# Altium schematic sheet Program Counter Electronic Scheme_2021-10-28.schdoc
size 264 x 133 mm
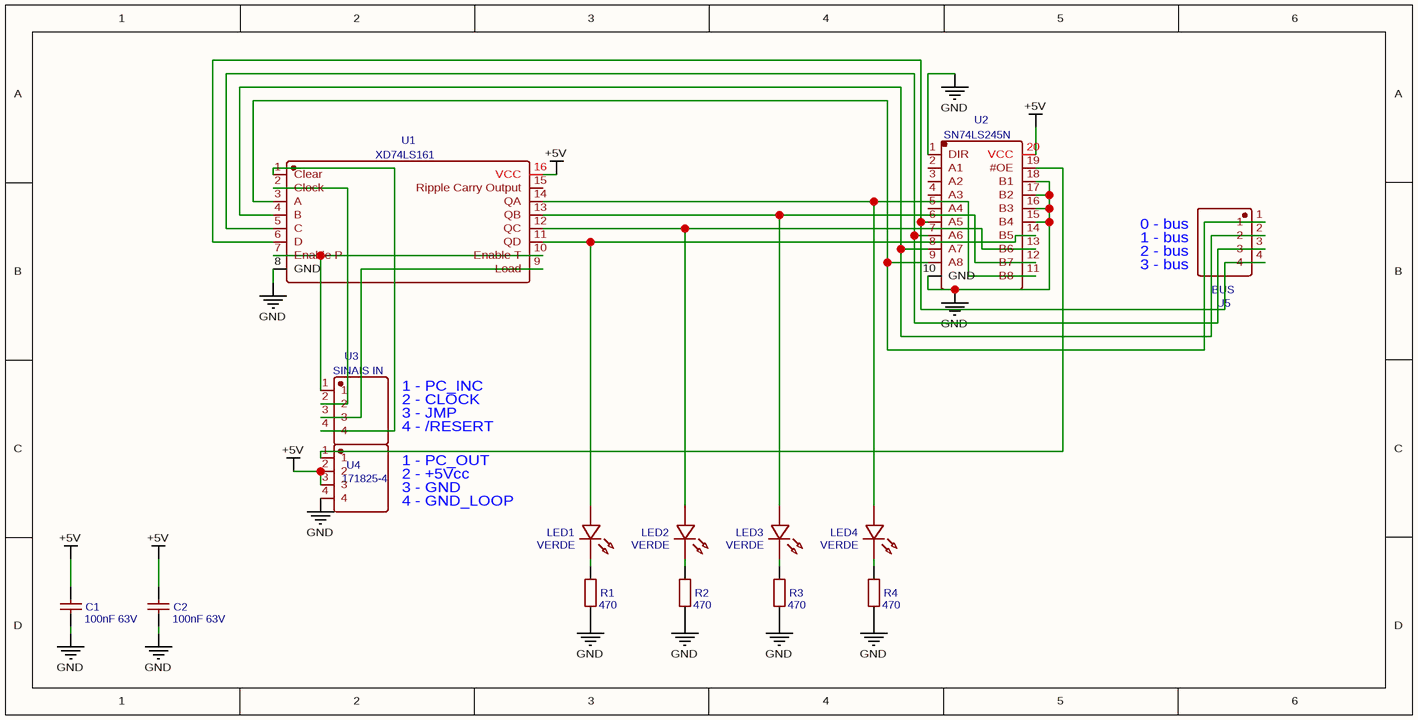
[diagram p0: Program Counter Electronic Scheme_2021-10-28.schdoc]

## Parts
C1  100nF 63V  [CAP-TH_L7.6-W3.8-P5.08-D0.51]
C2  100nF 63V  [CAP-TH_L7.6-W3.8-P5.08-D0.51]
LED1  VERDE  [LED-TH_BD3.0-P2.54-RD-GREEN]
LED2  VERDE  [LED-TH_BD3.0-P2.54-RD-GREEN]
LED3  VERDE  [LED-TH_BD3.0-P2.54-RD-GREEN]
LED4  VERDE  [LED-TH_BD3.0-P2.54-RD-GREEN]
R1  470  [RES-TH_BD3.0-L9.5-P13.50-D0.6]
R2  470  [RES-TH_BD3.0-L9.5-P13.50-D0.6]
R3  470  [RES-TH_BD3.0-L9.5-P13.50-D0.6]
R4  470  [RES-TH_BD3.0-L9.5-P13.50-D0.6]
U1  XD74LS161  [DIP-16_L19.2-W6.6-P2.54-LS7.6-BL]
U2  SN74LS245N  [DIP-20_L25.5-W10.0-P2.54-LS7.6-BL]
U3  SINAIS IN  [HDR-TH_4P-P2.54-D1.0]
U4  171825-4  [HDR-TH_4P-P2.54-D1.0]
U5  BUS  [HDR-TH_4P-P2.54-D1.0]

## Nets
+5V: C1.1 C2.1 U1.16(VCC) U2.20(VCC) U4.2 U4.3
GND: C1.2 C2.2 R1.2 R2.2 R3.2 R4.2 U1.8(GND) U2.1(DIR) U2.10(GND) U2.15(B4) U2.16(B3) U2.17(B2) U2.18(B1) U4.4
NetLED1_1: LED1.1(-) R1.1
NetLED1_2: LED1.2(+) U1.11(QD) U2.14(B5)
NetLED2_1: LED2.1(-) R2.1
NetLED2_2: LED2.2(+) U1.12(QC) U2.13(B6)
NetLED3_1: LED3.1(-) R3.1
NetLED3_2: LED3.2(+) U1.13(QB) U2.12(B7)
NetLED4_1: LED4.1(-) R4.1
NetLED4_2: LED4.2(+) U1.14(QA) U2.11(B8)
NetU1_1: U1.1(Clear) U3.4
NetU1_2: U1.2(Clock) U3.2
NetU1_3: U1.3(A) U2.9(A8) U5.1
NetU1_4: U1.4(B) U2.8(A7) U5.2
NetU1_5: U1.5(C) U2.7(A6) U5.3
NetU1_6: U1.6(D) U2.6(A5) U5.4
NetU1_7: U1.7(Enable_P) U1.10(Enable_T) U3.1
NetU1_9: U1.9(Load) U3.3
NetU2_19: U2.19(#OE) U4.1

Not connected (* = marked no-connect by the designer): U1 15(Ripple_Carry_Output); U2 2(A1) 3(A2) 4(A3) 5(A4)

## Notes on the sheet
- 2 - bus
- 0 - bus
- 1 - bus
- 3 - bus
- 1 - PC_INC
- 2 - CLOCK
- 3 - JMP
- 4 - /RESERT
- 1 - PC_OUT
- 2 - +5Vcc
- 3 - GND
- 4 - GND_LOOP

## Library data of the parts
C1 C2 = 100nF 63V: BOM_Manufacturer: AVX; BOM_Manufacturer Part: SR305C105KAR; nameAlias: Capacitance; Contributor: LCSC; BOM_Supplier: LCSC; BOM_Supplier Part: C444741; BOM_JLCPCB Part Class: Extended Part; spicePre: C; spiceSymbolName: SR305C105KAR
LED1-LED4 = VERDE: BOM_Manufacturer: Everlight Elec; BOM_Manufacturer Part: 264-7GD; Contributor: LCSC; BOM_Supplier: LCSC; BOM_Supplier Part: C605465; BOM_JLCPCB Part Class: Extended Part; spicePre: L; spiceSymbolName: 264-7GD
R1-R4 = 470: BOM_Manufacturer Part: CFR02SJ0823A10; BOM_Manufacturer: UniOhm; nameAlias: Resistance (Ohms); BOM_Supplier: LCSC; BOM_Supplier Part: C69876; spicePre: R; spiceSymbolName: CFR02SJ0823A10
U1 = XD74LS161: BOM_Manufacturer: XINLUDA; Contributor: LCSC; BOM_Supplier: LCSC; BOM_Supplier Part: C609766; BOM_Manufacturer Part: XD74LS161; BOM_JLCPCB Part Class: Extended Part; spicePre: U; spiceSymbolName: XD74LS161
U2 = SN74LS245N: BOM_Manufacturer: Texas Instruments; Contributor: LCSC; BOM_Supplier: LCSC; BOM_Supplier Part: C352966; BOM_Manufacturer Part: SN74LS245N; BOM_JLCPCB Part Class: Extended Part; spicePre: U; spiceSymbolName: SN74LS245N
U3 = SINAIS IN: BOM_Manufacturer: TE Connectivity; BOM_Manufacturer Part: 171825-4; Contributor: LCSC; BOM_Supplier: LCSC; BOM_Supplier Part: C210162; BOM_JLCPCB Part Class: Extended Part; spicePre: U; spiceSymbolName: 171825-4
U4 = 171825-4: BOM_Manufacturer: TE Connectivity; Contributor: LCSC; BOM_Supplier: LCSC; BOM_Supplier Part: C210162; BOM_Manufacturer Part: 171825-4; BOM_JLCPCB Part Class: Extended Part; spicePre: U; spiceSymbolName: 171825-4
U5 = BUS: BOM_Manufacturer: TE Connectivity; BOM_Manufacturer Part: 171825-4; Contributor: LCSC; BOM_Supplier: LCSC; BOM_Supplier Part: C210162; BOM_JLCPCB Part Class: Extended Part; spicePre: U; spiceSymbolName: 171825-4